# Altium schematic sheet Sheet7.SchDoc
size A
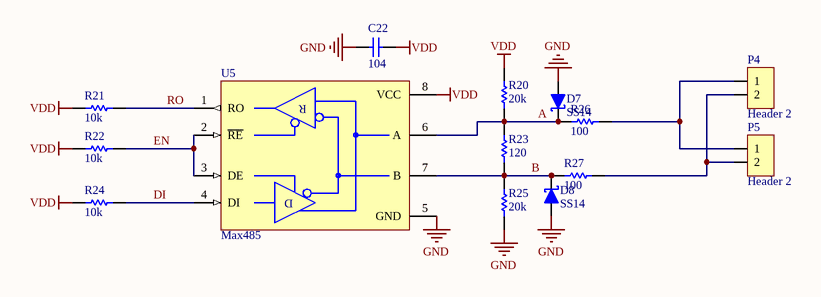
[diagram p0: Sheet7.SchDoc]

## Parts
C22  104  [C 0805 (2012)]
D7  SS14  [DO-214AC (SMA)]
D8  SS14  [DO-214AC (SMA)]
P4  Header 2  [HDR Domino 2]
P5  Header 2  [HDR Domino 2]
R20  20k  [R 0805 (2012)]
R21  10k  [R 0805 (2012)]
R22  10k  [R 0805 (2012)]
R23  120  [R 0805 (2012)]
R24  10k  [R 0805 (2012)]
R25  20k  [R 0805 (2012)]
R26  100  [R 0805 (2012)]
R27  100  [R 0805 (2012)]
U5  Max485  [SOIC-8]

## Nets
GND: C22.2 D7.1(A) D8.1(A) R25.1 U5.5(GND)
VDD: C22.1 R20.2 R21.2 R22.2 R24.2 U5.8(VCC)
A: D7.2(K) R20.1 R23.2 R26.2 U5.6(A)
B: D8.2(K) R23.1 R25.2 R27.2 U5.7(B)
DI: R24.1 U5.4(DI)
EN: R22.1 U5.2(~{RE}) U5.3(DE)
RO: R21.1 U5.1(RO)
NetP4_1: P4.1 P5.1 R26.1
NetP4_2: P4.2 P5.2 R27.1

## Notes on the sheet
- (in symbol MAX485) R; D

## Library data of the parts
C22 = Capacitor NP: Capacitor non-pol
D7 D8 = Diode Schottky: Schottky Diode; Published: 8-Jun-2000; LatestRevisionDate: 17-Jul-2002; LatestRevisionNote: Re-released for DXP Platform.; PackageReference: SMB; Publisher: Altium Limited; Code_JEDEC: DO-214-AA
P4 P5 = Header 2: Header, 2-Pin; LatestRevisionDate: 17-Jul-2002; LatestRevisionNote: Re-released for DXP Platform.; Publisher: Altium Limited
R20-R27 = Resistor: Published: 8-Jun-2000; LatestRevisionDate: 17-Jul-2002; LatestRevisionNote: Re-released for DXP Platform.; PackageReference: AXIAL-0.3; Publisher: Altium Limited